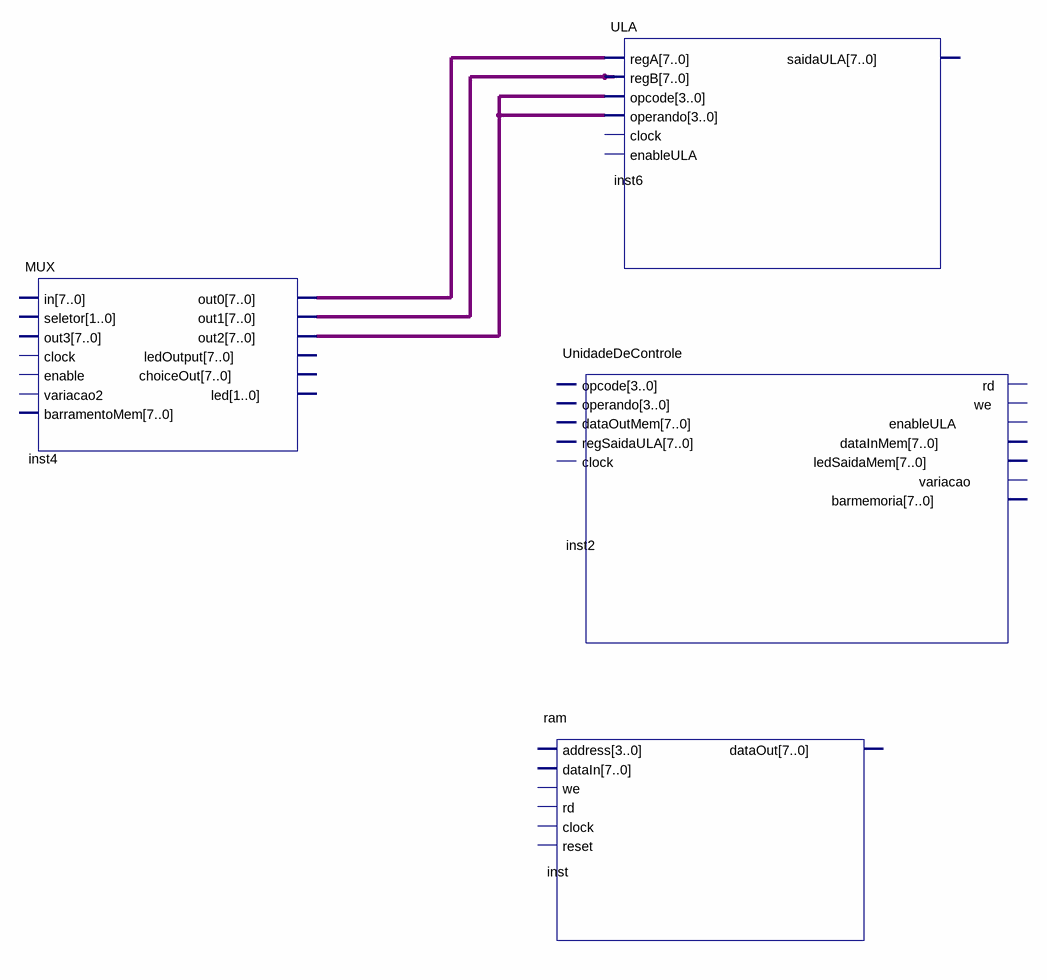
[diagram p0: schematic sheet]
// Quartus schematic Block2.bdf as structural Verilog: 4 symbols, 0 pins
module Block2 (
);

  wire [7:0] inst4_out0, inst4_out1, inst4_out2;

  MUX inst4 (
    .out0(inst4_out0), .out1(inst4_out1), .out2(inst4_out2));  // open: in, seletor, out3, clock, enable, variacao2, barramentoMem, ledOutput, choiceOut, led
  UnidadeDeControle inst2 ();  // open: opcode, operando, dataOutMem, regSaidaULA, clock, rd, we, enableULA, dataInMem, ledSaidaMem, variacao, barmemoria
  ram inst ();  // open: address, dataIn, we, rd, clock, reset, dataOut
  ULA inst6 (
    .regA(inst4_out0), .regB(inst4_out1), .opcode(inst4_out2), .operando(inst4_out2));  // open: clock, enableULA, saidaULA
endmodule
